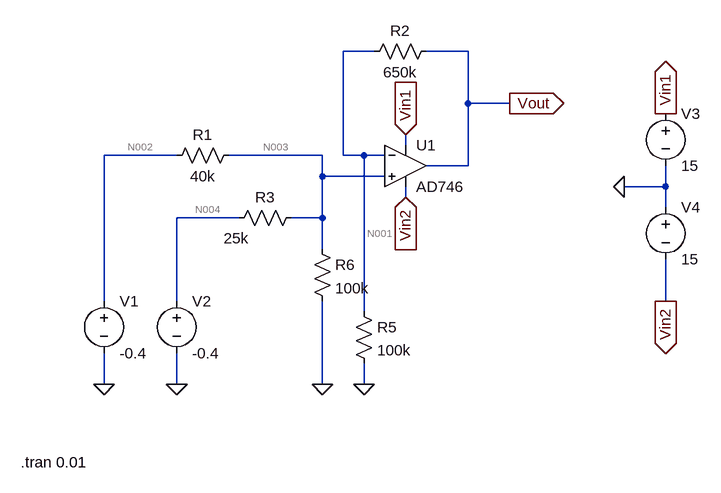
[diagram p0: schematic lab2_2.asc]
lab2_2.asc, the LTspice schematic file:
Version 4
SHEET 1 1016 680
WIRE 336 -64 288 -64
WIRE 480 -64 416 -64
WIRE 480 16 480 -64
WIRE 544 16 480 16
WIRE 384 80 384 64
WIRE 32 96 -80 96
WIRE 256 96 112 96
WIRE 288 96 288 -64
WIRE 320 96 288 96
WIRE 352 96 320 96
WIRE 480 112 480 16
WIRE 480 112 416 112
WIRE 256 128 256 96
WIRE 352 128 256 128
WIRE 784 144 784 112
WIRE 784 144 720 144
WIRE 384 160 384 144
WIRE 784 176 784 144
WIRE 128 192 32 192
WIRE 256 192 256 128
WIRE 256 192 208 192
WIRE 256 240 256 192
WIRE -80 320 -80 96
WIRE 32 320 32 192
WIRE 784 320 784 256
WIRE 320 336 320 96
WIRE -80 448 -80 400
WIRE 32 448 32 400
WIRE 256 448 256 320
WIRE 320 448 320 416
FLAG 320 448 0
FLAG 32 448 0
FLAG -80 448 0
FLAG 544 16 Vout
IOPIN 544 16 Out
FLAG 784 32 Vin1
IOPIN 784 32 Out
FLAG 720 144 0
FLAG 784 320 Vin2
IOPIN 784 320 Out
FLAG 384 64 Vin1
IOPIN 384 64 In
FLAG 384 160 Vin2
IOPIN 384 160 In
FLAG 256 448 0
SYMBOL res 128 80 R90
WINDOW 0 0 56 VBottom 2
WINDOW 3 32 56 VTop 2
SYMATTR InstName R1
SYMATTR Value 40k
SYMBOL res 432 -80 R90
WINDOW 0 0 56 VBottom 2
WINDOW 3 32 56 VTop 2
SYMATTR InstName R2
SYMATTR Value 650k
SYMBOL res 224 176 R90
WINDOW 0 0 56 VBottom 2
WINDOW 3 32 100 VTop 2
SYMATTR InstName R3
SYMATTR Value 25k
SYMBOL voltage -80 304 R0
WINDOW 123 0 0 Left 0
WINDOW 39 0 0 Left 0
SYMATTR InstName V1
SYMATTR Value -0.4
SYMBOL voltage 32 304 R0
WINDOW 123 0 0 Left 0
WINDOW 39 0 0 Left 0
SYMATTR InstName V2
SYMATTR Value -0.4
SYMBOL Opamps\\AD746 384 48 R0
SYMATTR InstName U1
SYMBOL voltage 784 16 R0
WINDOW 123 0 0 Left 0
WINDOW 39 0 0 Left 0
SYMATTR InstName V3
SYMATTR Value 15
SYMBOL voltage 784 160 R0
WINDOW 123 0 0 Left 0
WINDOW 39 0 0 Left 0
SYMATTR InstName V4
SYMATTR Value 15
SYMBOL res 304 320 R0
SYMATTR InstName R5
SYMATTR Value 100k
SYMBOL res 240 224 R0
SYMATTR InstName R6
SYMATTR Value 100k
TEXT -208 568 Left 2 !.tran 0.01

The netlist it stands for:
* lab2_2.asc
R1 N003 N002 40k
R2 Vout N001 650k
R3 N003 N004 25k
V1 N002 0 -0.4
V2 N004 0 -0.4
XU1 N003 N001 Vin1 Vin2 Vout AD746  ; pins In+ In- V+ V- OUT
V3 Vin1 0 15
V4 0 Vin2 15
R5 N001 0 100k
R6 N003 0 100k
.tran 0.01
.backanno
.end

* Results of the author's LTspice run, read from the files saved beside the schematic
* Operating Point, zero values left out:
*   V(n003) = -346.7 mV
*   V(n002) = -400 mV
*   V(vout) = -2.6 V
*   V(n001) = -346.7 mV
*   V(n004) = -400 mV
*   V(vin1) = 15 V
*   V(vin2) = -15 V
*   I(R6) = -3.467 µA
*   I(R5) = -3.467 µA
*   I(R3) = 2.133 µA
*   I(R2) = -3.467 µA
*   I(R1) = 1.333 µA
*   I(V4) = -4.9 mA
*   I(V3) = -4.897 mA
*   I(V2) = 2.133 µA
*   I(V1) = 1.333 µA
*   Ix(u1:1) = 98.91 pA
*   Ix(u1:2) = 98.91 pA
*   Ix(u1:3) = 4.897 mA
*   Ix(u1:4) = -4.9 mA
*   Ix(u1:5) = 3.467 µA